# Altium schematic sheet VFDControl.SchDoc
size A4
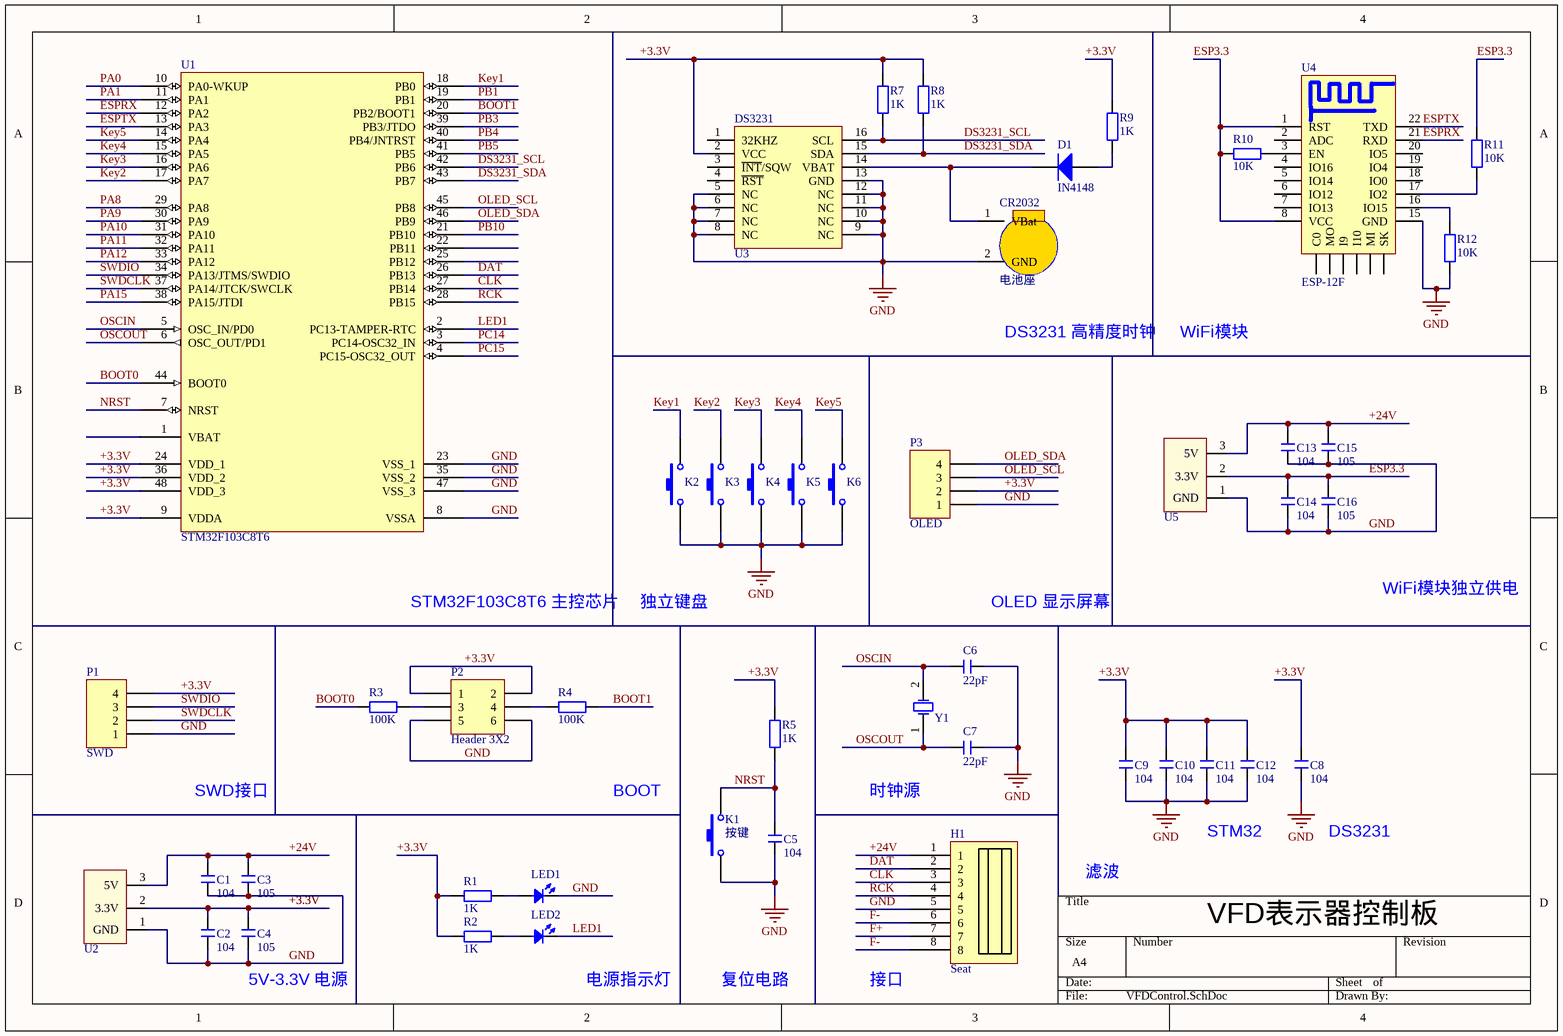
[diagram p0: VFDControl.SchDoc]

## Parts
C1  104  [C 0805]
C2  104  [C 0805]
C3  105  [C 0805]
C4  105  [C 0805]
C5  104  [C 0805]
C6  22pF  [C 0805]
C7  22pF  [C 0805]
C8  104  [C 0805]
C9  104  [C 0805]
C10  104  [C 0805]
C11  104  [C 0805]
C12  104  [C 0805]
C13  104  [C 0805]
C14  104  [C 0805]
C15  105  [C 0805]
C16  105  [C 0805]
CR2032  电池座  [CR2032 电池座]
D1  IN4148  [0805D]
H1  Seat  [SEAT8]
K1  按键  [按键]
K2  按键  [按键]  (value not drawn)
K3  按键  [按键]  (value not drawn)
K4  按键  [按键]  (value not drawn)
K5  按键  [按键]  (value not drawn)
K6  按键  [按键]  (value not drawn)
LED1  LED  [0805D]  (value not drawn)
LED2  LED  [0805D]  (value not drawn)
P1  SWD  [HDR1X4]
P2  Header 3X2  [HDR2X3]
P3  OLED  [HDR1X4]
R1  1K  [R 0805]
R2  1K  [R 0805]
R3  100K  [R 0805]
R4  100K  [R 0805]
R5  1K  [R 0805]
R7  1K  [R 0805]
R8  1K  [R 0805]
R9  1K  [R 0805]
R10  10K  [R 0805]
R11  10K  [R 0805]
R12  10K  [R 0805]
U1  STM32F103C8T6  [LQFP48 7X7_M]
U2  LM1117  [SOT-223]  (value not drawn)
U3  DS3231  [SOL-16]
U4  ESP-12F  [ESP-12F]
U5  LM1117  [SOT-223]  (value not drawn)
Y1  XTAL  [XTAL1]  (value not drawn)

## Nets
GND: C1.1 C2.1 C3.2 C4.2 C5.1 C6.2 C7.2 C8.1 C9.2 C10.2 C11.2 C12.2 C13.1 C14.1 C15.2 C16.2 CR2032.2(GND) H1.5 K1.1 K2.1 K3.1 K4.1 K5.1 K6.1 LED1.2(K) P1.1 P2.5 P2.6 P3.1 R12.1 U1.8(VSSA) U1.23(VSS_1) U1.35(VSS_2) U1.47(VSS_3) U2.1(GND) U3.5(NC) U3.6(NC) U3.7(NC) U3.8(NC) U3.9(NC) U3.10(NC) U3.11(NC) U3.12(NC) U3.13(GND) U4.15(SK) U5.1(GND)
+3.3V: C2.2 C4.1 C8.2 C9.1 C10.1 C11.1 C12.1 P1.4 P2.1 P2.2 P3.2 R1.1 R2.1 R5.2 R7.2 R8.2 R9.1 U1.9(VDDA) U1.24(VDD_1) U1.36(VDD_2) U1.48(VDD_3) U2.2(3.3V) U3.2(VCC)
+24V: C1.2 C3.1 C13.2 C15.1 H1.1 U2.3(5V) U5.3(5V)
BOOT0: R3.1 U1.44(BOOT0)
BOOT1: R4.2 U1.20(PB2/BOOT1)
CLK: H1.3 U1.27(PB14)
DAT: H1.2 U1.26(PB13)
DS3231_SCL: R7.1 U1.42(PB6) U3.16(SCL)
DS3231_SDA: R8.1 U1.43(PB7) U3.15(SDA)
ESP3.3: C14.2 C16.1 R10.1 R11.2 U4.1(RST) U4.8(VCC) U5.2(3.3V)
ESPRX: U1.12(PA2) U4.21(RXD)
ESPTX: U1.13(PA3) U4.22(TXD)
F+: H1.7
F-: H1.6 H1.8
Key1: K2.2 U1.18(PB0)
Key2: K3.2 U1.17(PA7)
Key3: K4.2 U1.16(PA6)
Key4: K5.2 U1.15(PA5)
Key5: K6.2 U1.14(PA4)
LED1: LED2.2(K) U1.2(PC13-TAMPER-RTC)
NRST: C5.2 K1.2 R5.1 U1.7(NRST)
OLED_SCL: P3.3 U1.45(PB8)
OLED_SDA: P3.4 U1.46(PB9)
OSCIN: C6.1 U1.5(OSC_IN/PD0) Y1.2(OSC2)
OSCOUT: C7.1 U1.6(OSC_OUT/PD1) Y1.1(OSC1)
PA0: U1.10(PA0-WKUP)
PA1: U1.11(PA1)
PA8: U1.29(PA8)
PA9: U1.30(PA9)
PA10: U1.31(PA10)
PA11: U1.32(PA11)
PA12: U1.33(PA12)
PA15: U1.38(PA15/JTDI)
PB1: U1.19(PB1)
PB3: U1.39(PB3/JTDO)
PB4: U1.40(PB4/JNTRST)
PB5: U1.41(PB5)
PB10: U1.21(PB10)
PC14: U1.3(PC14-OSC32_IN)
PC15: U1.4(PC15-OSC32_OUT)
RCK: H1.4 U1.28(PB15)
SWDCLK: P1.2 U1.37(PA14/JTCK/SWCLK)
SWDIO: P1.3 U1.34(PA13/JTMS/SWDIO)
NetCR2032_1: CR2032.1(VBat) D1.2(K) U3.14(VBAT)
NetD1_1: D1.1(A) R9.2
NetLED1_1: LED1.1(A) R1.2
NetLED2_1: LED2.1(A) R2.2
NetP2_3: P2.3 R3.2
NetP2_4: P2.4 R4.1
NetR10_2: R10.2 U4.3(EN)
NetR11_1: R11.1 U4.17(IO2)
NetR12_2: R12.2 U4.16(IO15)

Not connected (* = marked no-connect by the designer): U1 1(VBAT) 22(PB11) 25(PB12); U3 1(32KHZ) 3(~{INT}/SQW) 4(~{RST}); U4 2(ADC) 4(IO16) 5(IO14) 6(IO12) 7(IO13) 9(C0) 10(MO) 11(I9) 12(I10) 13(MI) 18(IO0) 19(IO4) 20(IO5)

## Notes on the sheet
- DS3231 高精度时钟
- WiFi模块
- STM32F103C8T6 主控芯片
- 独立键盘
- OLED 显示屏幕
- WiFi模块独立供电
- SWD接口
- BOOT
- 时钟源
- STM32
- DS3231
- 滤波
- 5V-3.3V 电源
- (near LED2) 电源指示灯
- 复位电路
- 接口
- VFD表示器控制板

## Library data of the parts
C1-C16 = C: 无极性贴片电容; 版权归属: 源创客; BOM名称: 无极性贴片电容; 学习资源: www.ooocke.com
CR2032 = CR2032 电池座
D1 = 二级管
P1 P3 = Header 4: Header, 4-Pin; LatestRevisionDate: 17-Jul-2002; LatestRevisionNote: Re-released for DXP Platform.; Publisher: Altium Limited
P2 = Header 3X2: Header, 3-Pin, Dual row; LatestRevisionDate: 17-Jul-2002; LatestRevisionNote: Re-released for DXP Platform.; Publisher: Altium Limited
R1-R5 R7-R12 = R: 贴片电阻; 版权归属: 源创客; BOM名称: 贴片电阻; 学习资源: www.ooocke.com
U1 = STM32F103C8T6: Flaah:64/RAM:20/IO:36; BOM名称: 32位STM单片机; 版权归属: 源创客; 学习资源: www.ooocke.com
LED1 LED2 = LED: Published: 8-Jun-2000; LatestRevisionDate: 08-Jul-2005; LatestRevisionNote: Mech Layer 1 removed.; PackageReference: LED-0; Publisher: Altium Limited; PackageDescription: LED; 2 Leads
Y1 = XTAL: Published: 8-Jun-2000; LatestRevisionDate: 17-Jul-2002; LatestRevisionNote: Re-released for DXP Platform.; PackageReference: R38; Publisher: Altium Limited; PackageDescription: Crystal, Thru-Hole; 2 Leads; Body 3.1 x 8.2 mm (Dia.xH)